# Altium project extension-010005.PrjPcb (part 2 of 2)
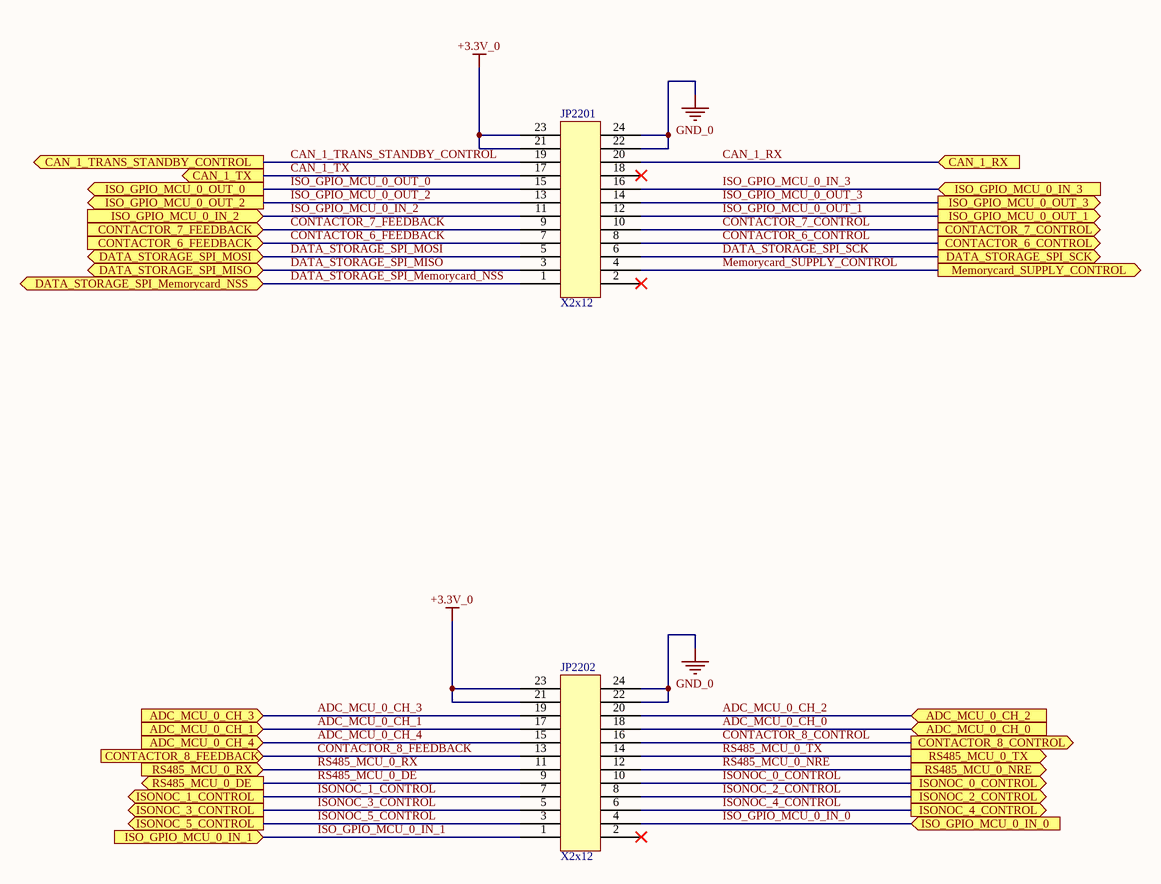
[diagram p9: connectors_to_BMS_master.SchDoc]

## Nets that join several sheets
+3.3V_0: CAN_1 (C807.2 IC803.1 R804.1), isolated_rs485 (C1306.1 IC1303.1 IC1303.7), analog_inputs_not_isolated (C1703.1 C1704.1 IC1701.3 IC1701.4), isolated_NO_contacts (6 pins), iso_GPIO_4in_4out (6 pins), FPGA_SPI_interface (LSP2101.1 SV2101.7), connectors_to_BMS_master (JP2201.21 JP2201.23 JP2202.21 JP2202.23)
GND_0: CAN_1 (6 pins), isolated_rs485 (C1306.2 IC1303.2 IC1303.8), analog_inputs_not_isolated (22 pins), isolated_NO_contacts (12 pins), iso_GPIO_4in_4out (6 pins), FPGA_SPI_interface (LSP2102.1 SV2101.3 SV2101.4), connectors_to_BMS_master (JP2201.22 JP2201.24 JP2202.22 JP2202.24)
GND_EXT_0: interlock (SV901.8), contactor_connectors (X1201.1 X1202.1 X1203.1), iso_GPIO_4in_4out (20 pins)
SUPPLY_EXT_0: interlock (SV901.5), iso_GPIO_4in_4out (C1901.1 C1902.1 IC1901.3)
ADC_MCU_0_CH_0: analog_inputs_not_isolated (5 pins), connectors_to_BMS_master (JP2202.18)
ADC_MCU_0_CH_1: analog_inputs_not_isolated (5 pins), connectors_to_BMS_master (JP2202.17)
ADC_MCU_0_CH_2: analog_inputs_not_isolated (5 pins), connectors_to_BMS_master (JP2202.20)
ADC_MCU_0_CH_3: analog_inputs_not_isolated (5 pins), connectors_to_BMS_master (JP2202.19)
ADC_MCU_0_CH_4: analog_inputs_not_isolated (5 pins), connectors_to_BMS_master (JP2202.15)
CAN_1_RX: CAN_1 (IC803.5 LSP806.1), connectors_to_BMS_master (JP2201.20)
CAN_1_TRANS_STANDBY_CONTROL: CAN_1 (R806.2), connectors_to_BMS_master (JP2201.19)
CAN_1_TX: CAN_1 (IC803.3 LSP805.1), connectors_to_BMS_master (JP2201.17)
CONTACTORS_COMMON_NEG: interlock (T901.4), contactor_connectors (X1201.4 X1202.4 X1203.4)
ISO_GPIO_MCU_0_IN_0: iso_GPIO_4in_4out (IC1902.14 LSP1903.1), connectors_to_BMS_master (JP2202.4)
ISO_GPIO_MCU_0_IN_1: iso_GPIO_4in_4out (IC1902.13 LSP1901.1), connectors_to_BMS_master (JP2202.1)
ISO_GPIO_MCU_0_IN_2: iso_GPIO_4in_4out (IC1903.14 LSP1905.1), connectors_to_BMS_master (JP2201.11)
ISO_GPIO_MCU_0_IN_3: iso_GPIO_4in_4out (IC1903.13 LSP1907.1), connectors_to_BMS_master (JP2201.16)
ISO_GPIO_MCU_0_OUT_0: iso_GPIO_4in_4out (IC1902.12 LSP1904.1), connectors_to_BMS_master (JP2201.15)
ISO_GPIO_MCU_0_OUT_1: iso_GPIO_4in_4out (IC1902.11 LSP1902.1), connectors_to_BMS_master (JP2201.12)
ISO_GPIO_MCU_0_OUT_2: iso_GPIO_4in_4out (IC1903.12 LSP1906.1), connectors_to_BMS_master (JP2201.13)
ISO_GPIO_MCU_0_OUT_3: iso_GPIO_4in_4out (IC1903.11 LSP1908.1), connectors_to_BMS_master (JP2201.14)
ISONOC_0_CONTROL: isolated_NO_contacts (LSP2001.1 R2001.2), connectors_to_BMS_master (JP2202.10)
ISONOC_1_CONTROL: isolated_NO_contacts (LSP2003.1 R2007.2), connectors_to_BMS_master (JP2202.7)
ISONOC_2_CONTROL: isolated_NO_contacts (LSP2005.1 R2013.2), connectors_to_BMS_master (JP2202.8)
ISONOC_3_CONTROL: isolated_NO_contacts (LSP2002.1 R2002.2), connectors_to_BMS_master (JP2202.5)
ISONOC_4_CONTROL: isolated_NO_contacts (LSP2004.1 R2008.2), connectors_to_BMS_master (JP2202.6)
ISONOC_5_CONTROL: isolated_NO_contacts (LSP2006.1 R2014.2), connectors_to_BMS_master (JP2202.3)
RS485_MCU_0_DE: isolated_rs485 (IC1303.5 LSP1302.1), connectors_to_BMS_master (JP2202.9)
RS485_MCU_0_NRE: isolated_rs485 (IC1303.4 LSP1303.1), connectors_to_BMS_master (JP2202.12)
RS485_MCU_0_RX: isolated_rs485 (IC1303.6 LSP1304.1), connectors_to_BMS_master (JP2202.11)
RS485_MCU_0_TX: isolated_rs485 (IC1303.3 LSP1301.1), connectors_to_BMS_master (JP2202.14)

## Assembly variants
default: not fitted D1001 D1002 D1003 D2001 D2002 D2003 D2004 D2005 D2006 SV2101